# EAGLE design lpf (EAGLE 9.0.0)
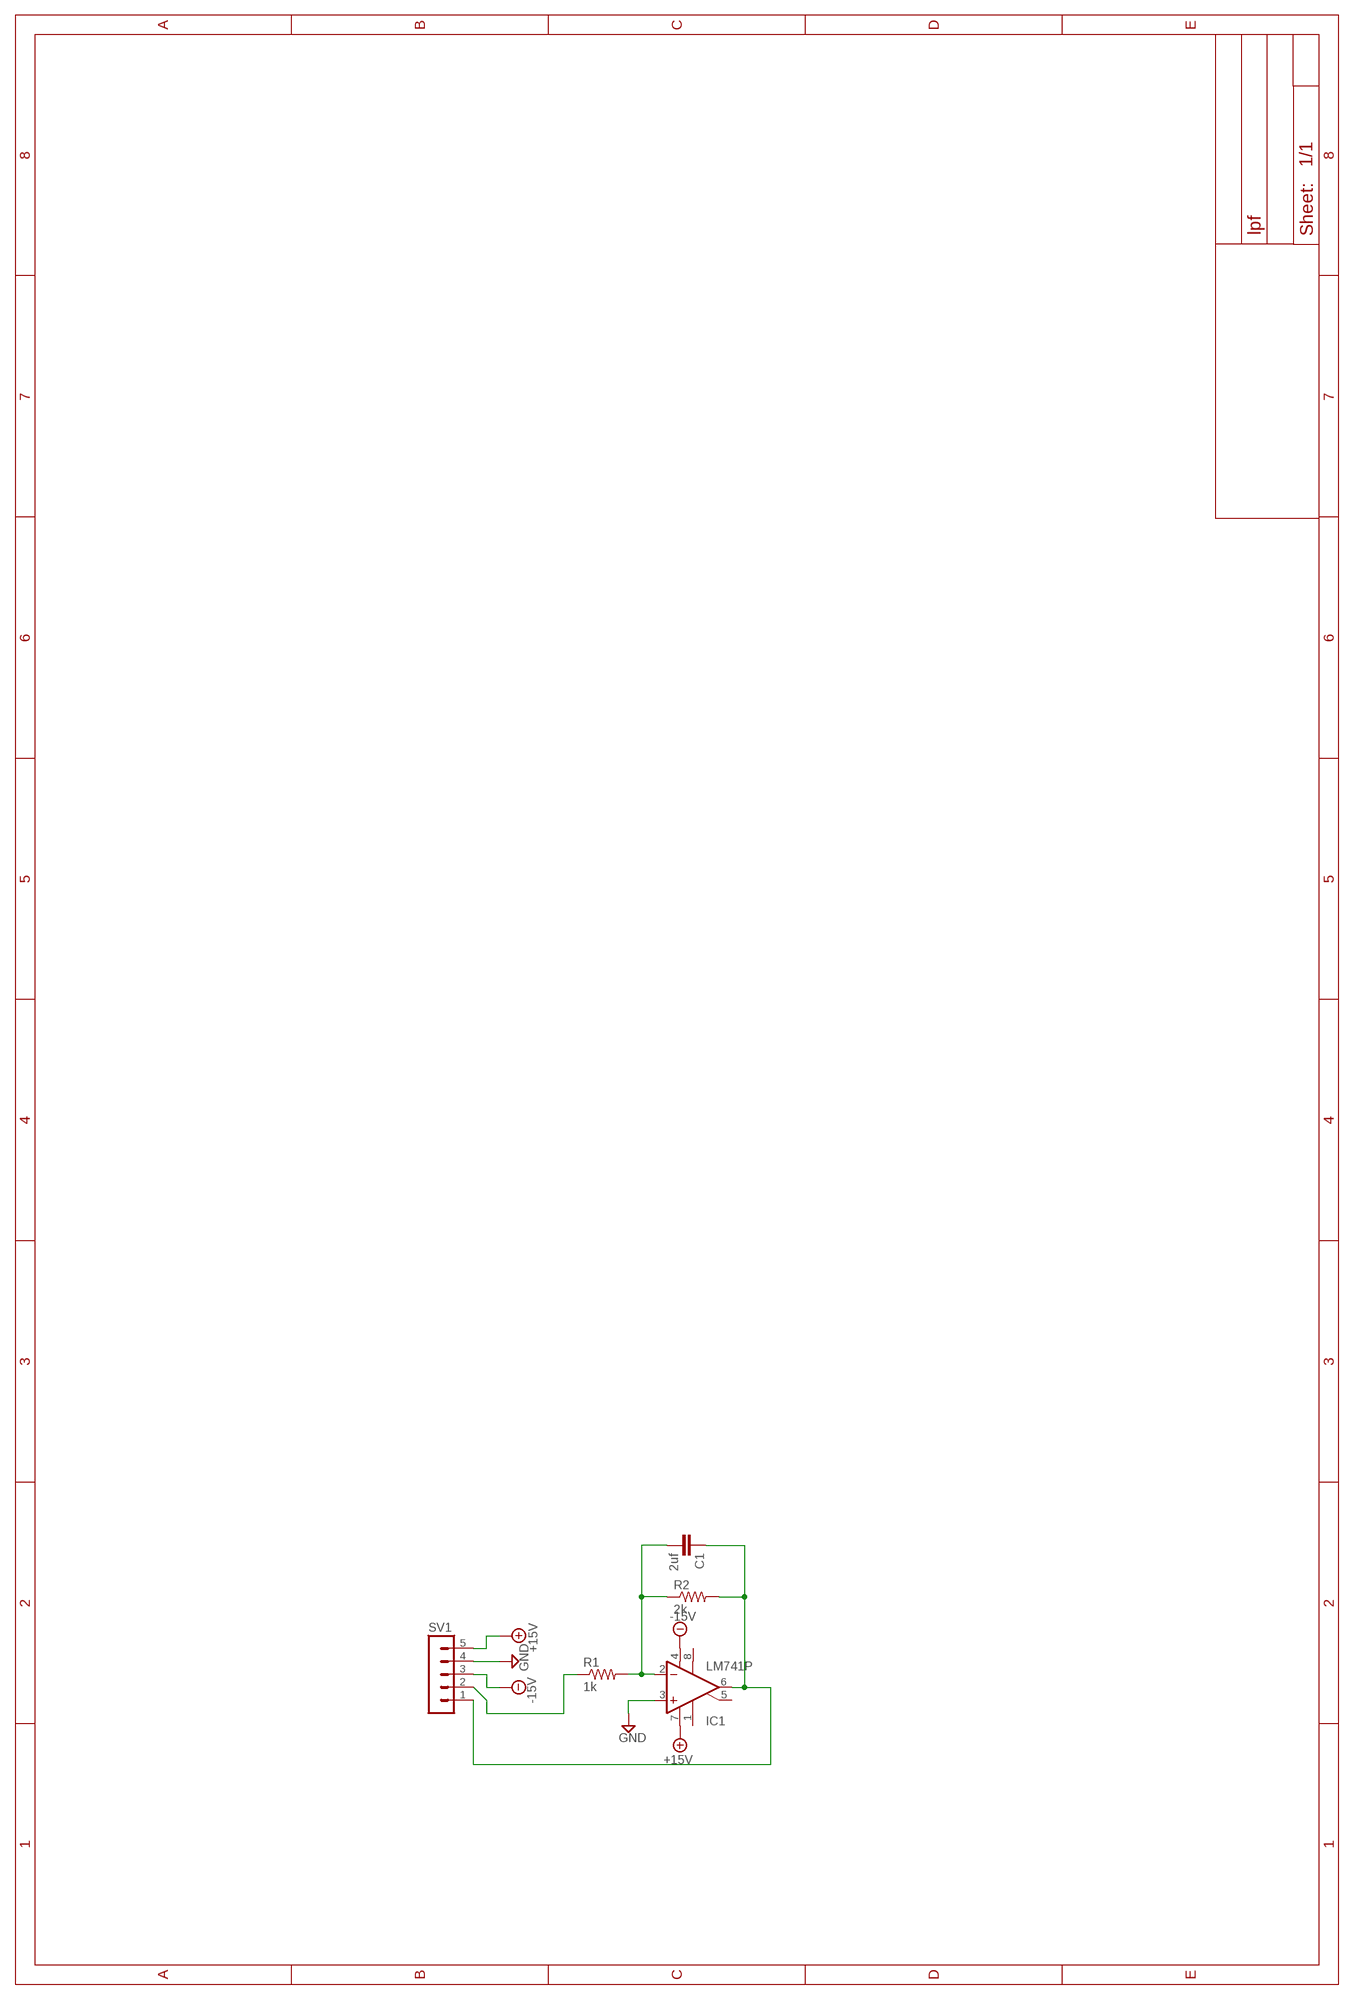
[diagram p0: schematic, sheet 1]

## Parts
C1  2uf  C-EU025-024X044  [C025-024X044]
IC1  LM741P  [DIL08]
R1  1k  R-US_0204/2V  [0204V]
R2  2k  R-US_0204/2V  [0204V]
SV1  MA05-1  [MA05-1]

## Nets
+15V: IC1.7(V+) SV1.5
-15V: IC1.4(V-) SV1.3
GND: IC1.3(+IN) SV1.4
N$1: C1.2 IC1.2(-IN) R1.2 R2.1
N$2: C1.1 IC1.6(OUT) R2.2 SV1.1
N$4: R1.1 SV1.2
Unconnected: IC1.1(ON1) IC1.5(ON2) IC1.8(OPT)

## Library data of the parts
C1 = resistor:C-EU: CAPACITOR, European symbol
IC1 = linear:*741: OP AMP
R1 R2 = resistor:R-US_: RESISTOR, American symbol
SV1 = con-lstb:MA05-1: PIN HEADER; OC_FARNELL: unknown; OC_NEWARK: unknown

## Board
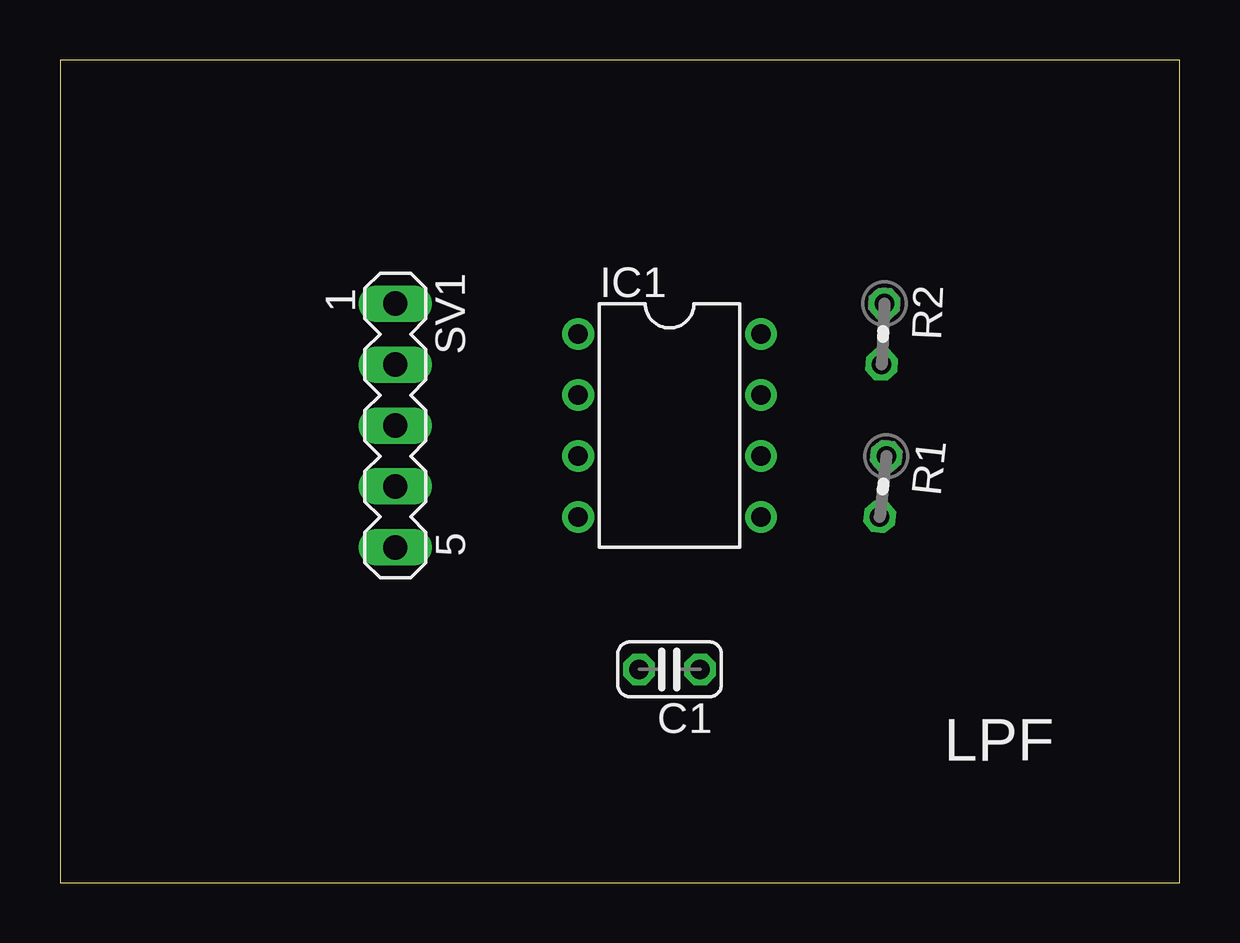
[diagram p1: board, top side]
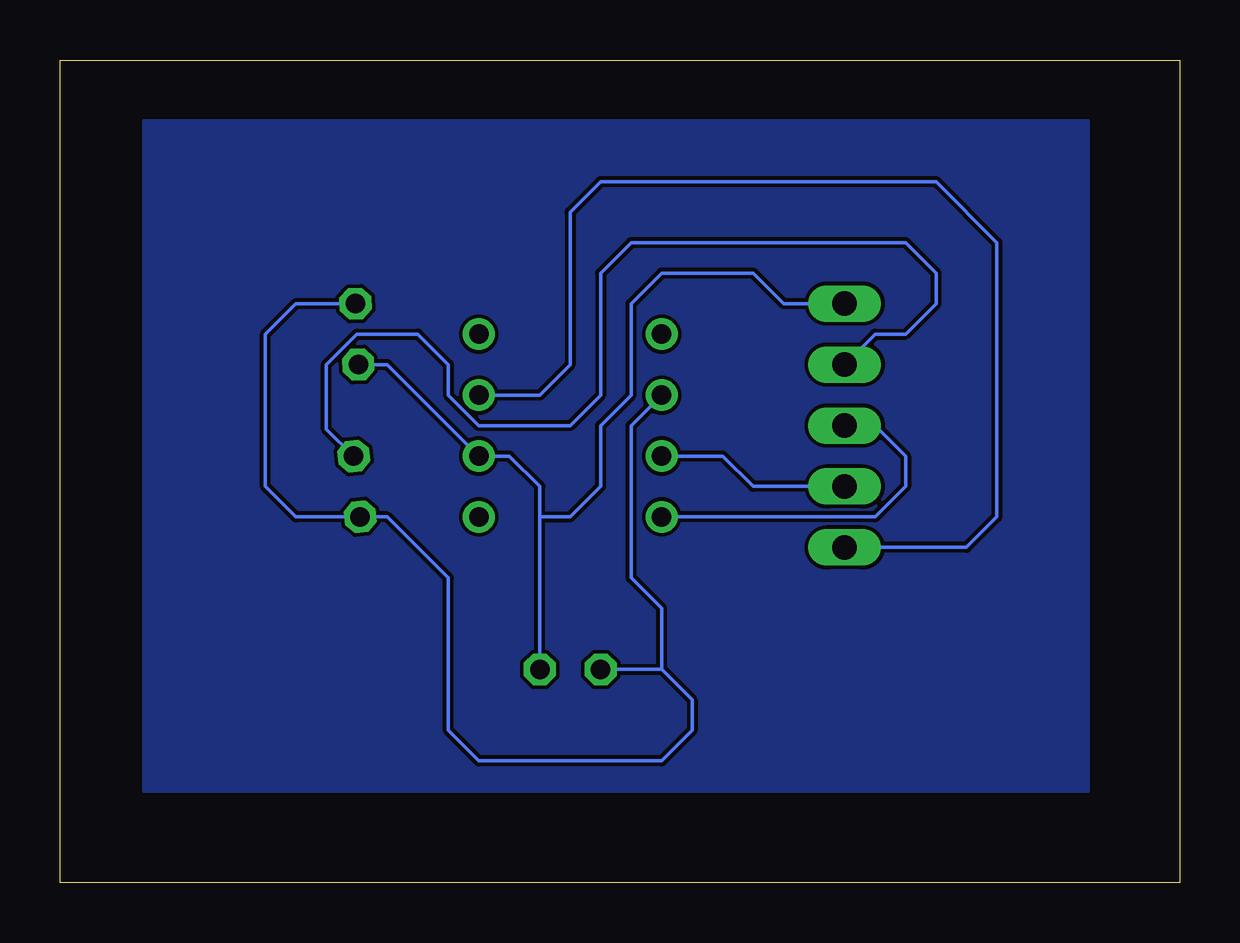
[diagram p2: board, bottom side, seen from below]

Size 46.66 x 34.28 mm. Coordinates in mm from the lower left corner, seen from the top.
Outline: 0,0 46.66,0 46.66,34.28 0,34.28 0,0
Copper layers (1*16): Top 0.035mm / dielectric 1.5mm / Bottom 0.035mm
Design rules "default": minimum track width 6mil, minimum drill 0.35mm, track to track 6mil, track to pad 6mil, pad to pad 6mil, via to via 6mil, smd to smd 6mil, copper to edge 40mil, drill to drill 6mil, minimum pad ring 10mil, minimum via ring 8mil, stop-mask expansion 4mil, vias tented up to drill 0mil, thermal gap 10mil

### Footprints (pad centres in the part's own frame; a part is rotated, then mirrored left to right if it is on the bottom)
C025-024X044 = drill 0.813 octagon: 1 -1.27,0; 2 1.27,0
DIL08 = drill 0.813 pad 1.27: 1 -3.81,-3.81; 2 -1.27,-3.81; 3 1.27,-3.81; 4 3.81,-3.81; 5 3.81,3.81; 6 1.27,3.81; 7 -1.27,3.81; 8 -3.81,3.81
0204V = drill 0.813 octagon: 1 -1.27,0; 2 1.27,0
MA05-1 = drill 1.016 long: 1 -5.08,0; 2 -2.54,0; 3 0,0; 4 2.54,0; 5 5.08,0

### Placement (x,y rotation side)
C1  25.4,8.89 180 top
IC1  25.4,19.05 270 top
R1  34.29,16.51 263.7 top
R2  34.29,22.86 267.4 top
SV1  13.97,19.05 270 top

### Tracks (layer width: path | path; a pad name or v marks a point on that pad's centre or on a via)
+15V
  Bottom 0.152: IC1.7 26.67,20.32 25.4,21.59 25.4,27.94 24.13,29.21 10.16,29.21 7.62,26.67 7.62,15.24 8.89,13.97 SV1.5
-15V
  Bottom 0.152: SV1.3 12.7,19.05 11.43,17.78 11.43,16.51 12.7,15.24 IC1.4
GND
  Bottom 0.152: SV1.4 17.78,16.51 19.05,17.78 IC1.3
N$1
  Bottom 0.152: C1.2 21.59,8.89 | 21.59,8.89 20.32,7.62 20.32,6.35 21.59,5.08 29.21,5.08 30.48,6.35 30.48,12.7 33.03,15.25 R1.2 36.83,15.24 38.1,16.51 38.1,22.86 36.83,24.13 R2.1 | 21.59,8.89 21.59,11.43 22.86,12.7 22.86,19.05 IC1.2
N$2
  Bottom 0.152: C1.1 26.67,15.24 | 26.67,15.24 26.67,16.51 27.94,17.78 IC1.6 33.02,21.59 R2.2 | SV1.1 16.51,24.13 17.78,25.4 21.59,25.4 22.86,24.13 22.86,20.32 24.13,19.05 24.13,16.51 25.4,15.24 26.67,15.24
N$3
  pour Bottom: 3.81,31.75 43.18,31.75 43.18,3.81 3.81,3.81
N$4
  Bottom 0.152: SV1.2 12.7,22.86 11.43,22.86 10.16,24.13 10.16,25.4 11.43,26.67 22.86,26.67 24.13,25.4 24.13,20.32 25.4,19.05 29.21,19.05 30.48,20.32 30.48,21.59 31.75,22.86 34.29,22.86 35.56,21.59 35.56,18.9 R1.1

### Text on the board
tNames: LPF